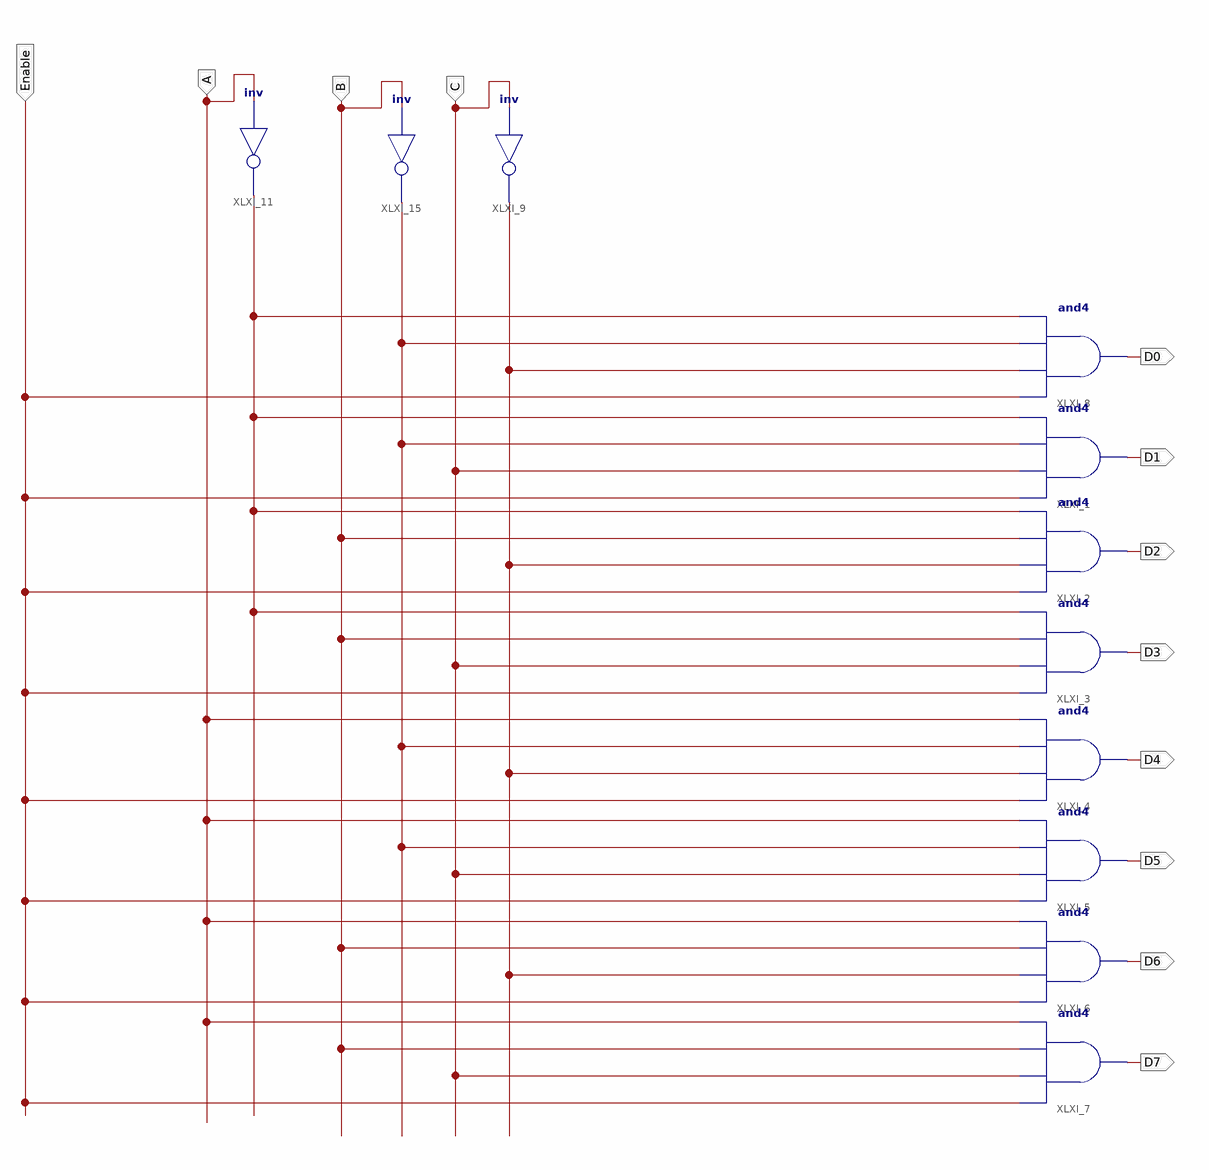
[diagram p0: schematic sheet 1]
// Xilinx ISE schematic sprinkler_circuit.sch (kintex7l) as structural Verilog: 11 symbols, 12 ports
module sprinkler_circuit (
  input  A,
  input  C,
  input  B,
  input  Enable,
  output D0,
  output D1,
  output D2,
  output D3,
  output D4,
  output D5,
  output D6,
  output D7
);

  wire XLXN_10, XLXN_12, XLXN_21;

  and XLXI_1 (D1, Enable, C, XLXN_21, XLXN_12);
  and XLXI_2 (D2, Enable, XLXN_10, B, XLXN_12);
  and XLXI_3 (D3, Enable, C, B, XLXN_12);
  and XLXI_4 (D4, Enable, XLXN_10, XLXN_21, A);
  and XLXI_5 (D5, Enable, C, XLXN_21, A);
  and XLXI_6 (D6, Enable, XLXN_10, B, A);
  and XLXI_7 (D7, Enable, C, B, A);
  and XLXI_8 (D0, Enable, XLXN_10, XLXN_21, XLXN_12);
  not XLXI_9 (XLXN_10, C);
  not XLXI_11 (XLXN_12, A);
  not XLXI_15 (XLXN_21, B);
endmodule
